# Altium project koruza-hs-boad.PrjPcb
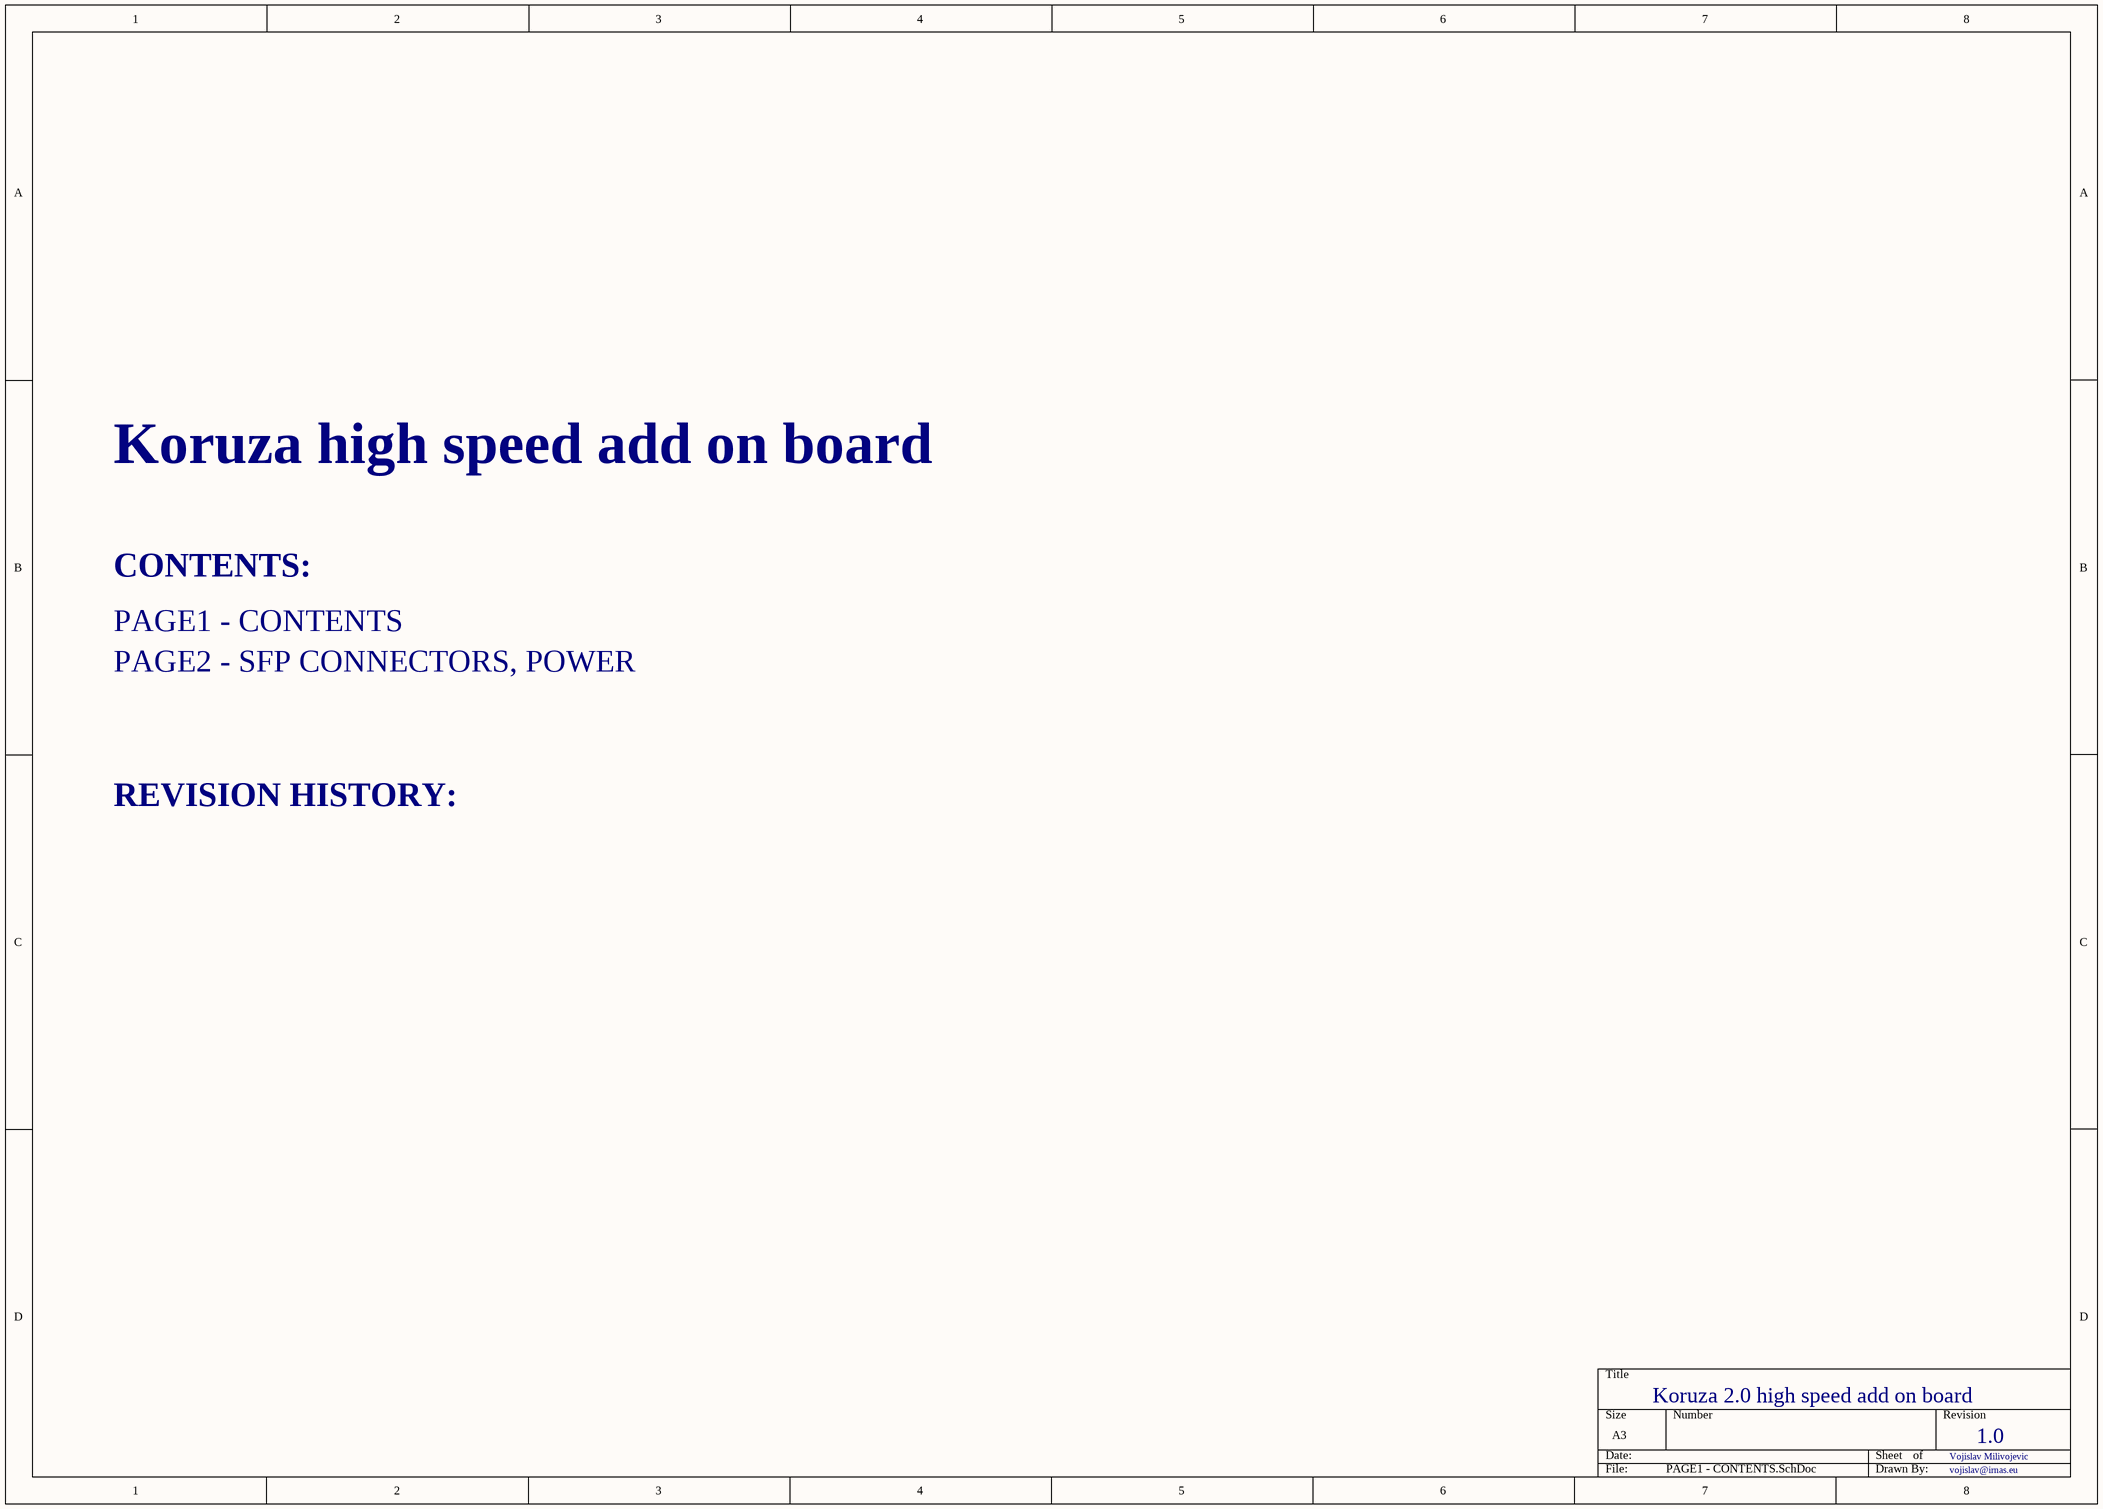
[diagram p0: PAGE1 - CONTENTS.SchDoc]
2 sheets, 44 parts. Net scope: global (net labels, ports and power ports of the same name join across sheets).
Board file: PCB.PcbDoc
Sheets:
  PAGE1 - CONTENTS.SchDoc
  PAGE2 - SFP CONNECTORS, POWER.SchDoc

## Sheet PAGE1 - CONTENTS.SchDoc
size A3

### Notes on the sheet
- Koruza high speed add on board
- CONTENTS:
- PAGE1 - CONTENTS
- PAGE2 - SFP CONNECTORS, POWER
- REVISION HISTORY:
- Koruza 2.0 high speed add on board
- Vojislav Milivojevic
- 1.0
- vojislav@irnas.eu

## Sheet PAGE2 - SFP CONNECTORS, POWER.SchDoc
size A3
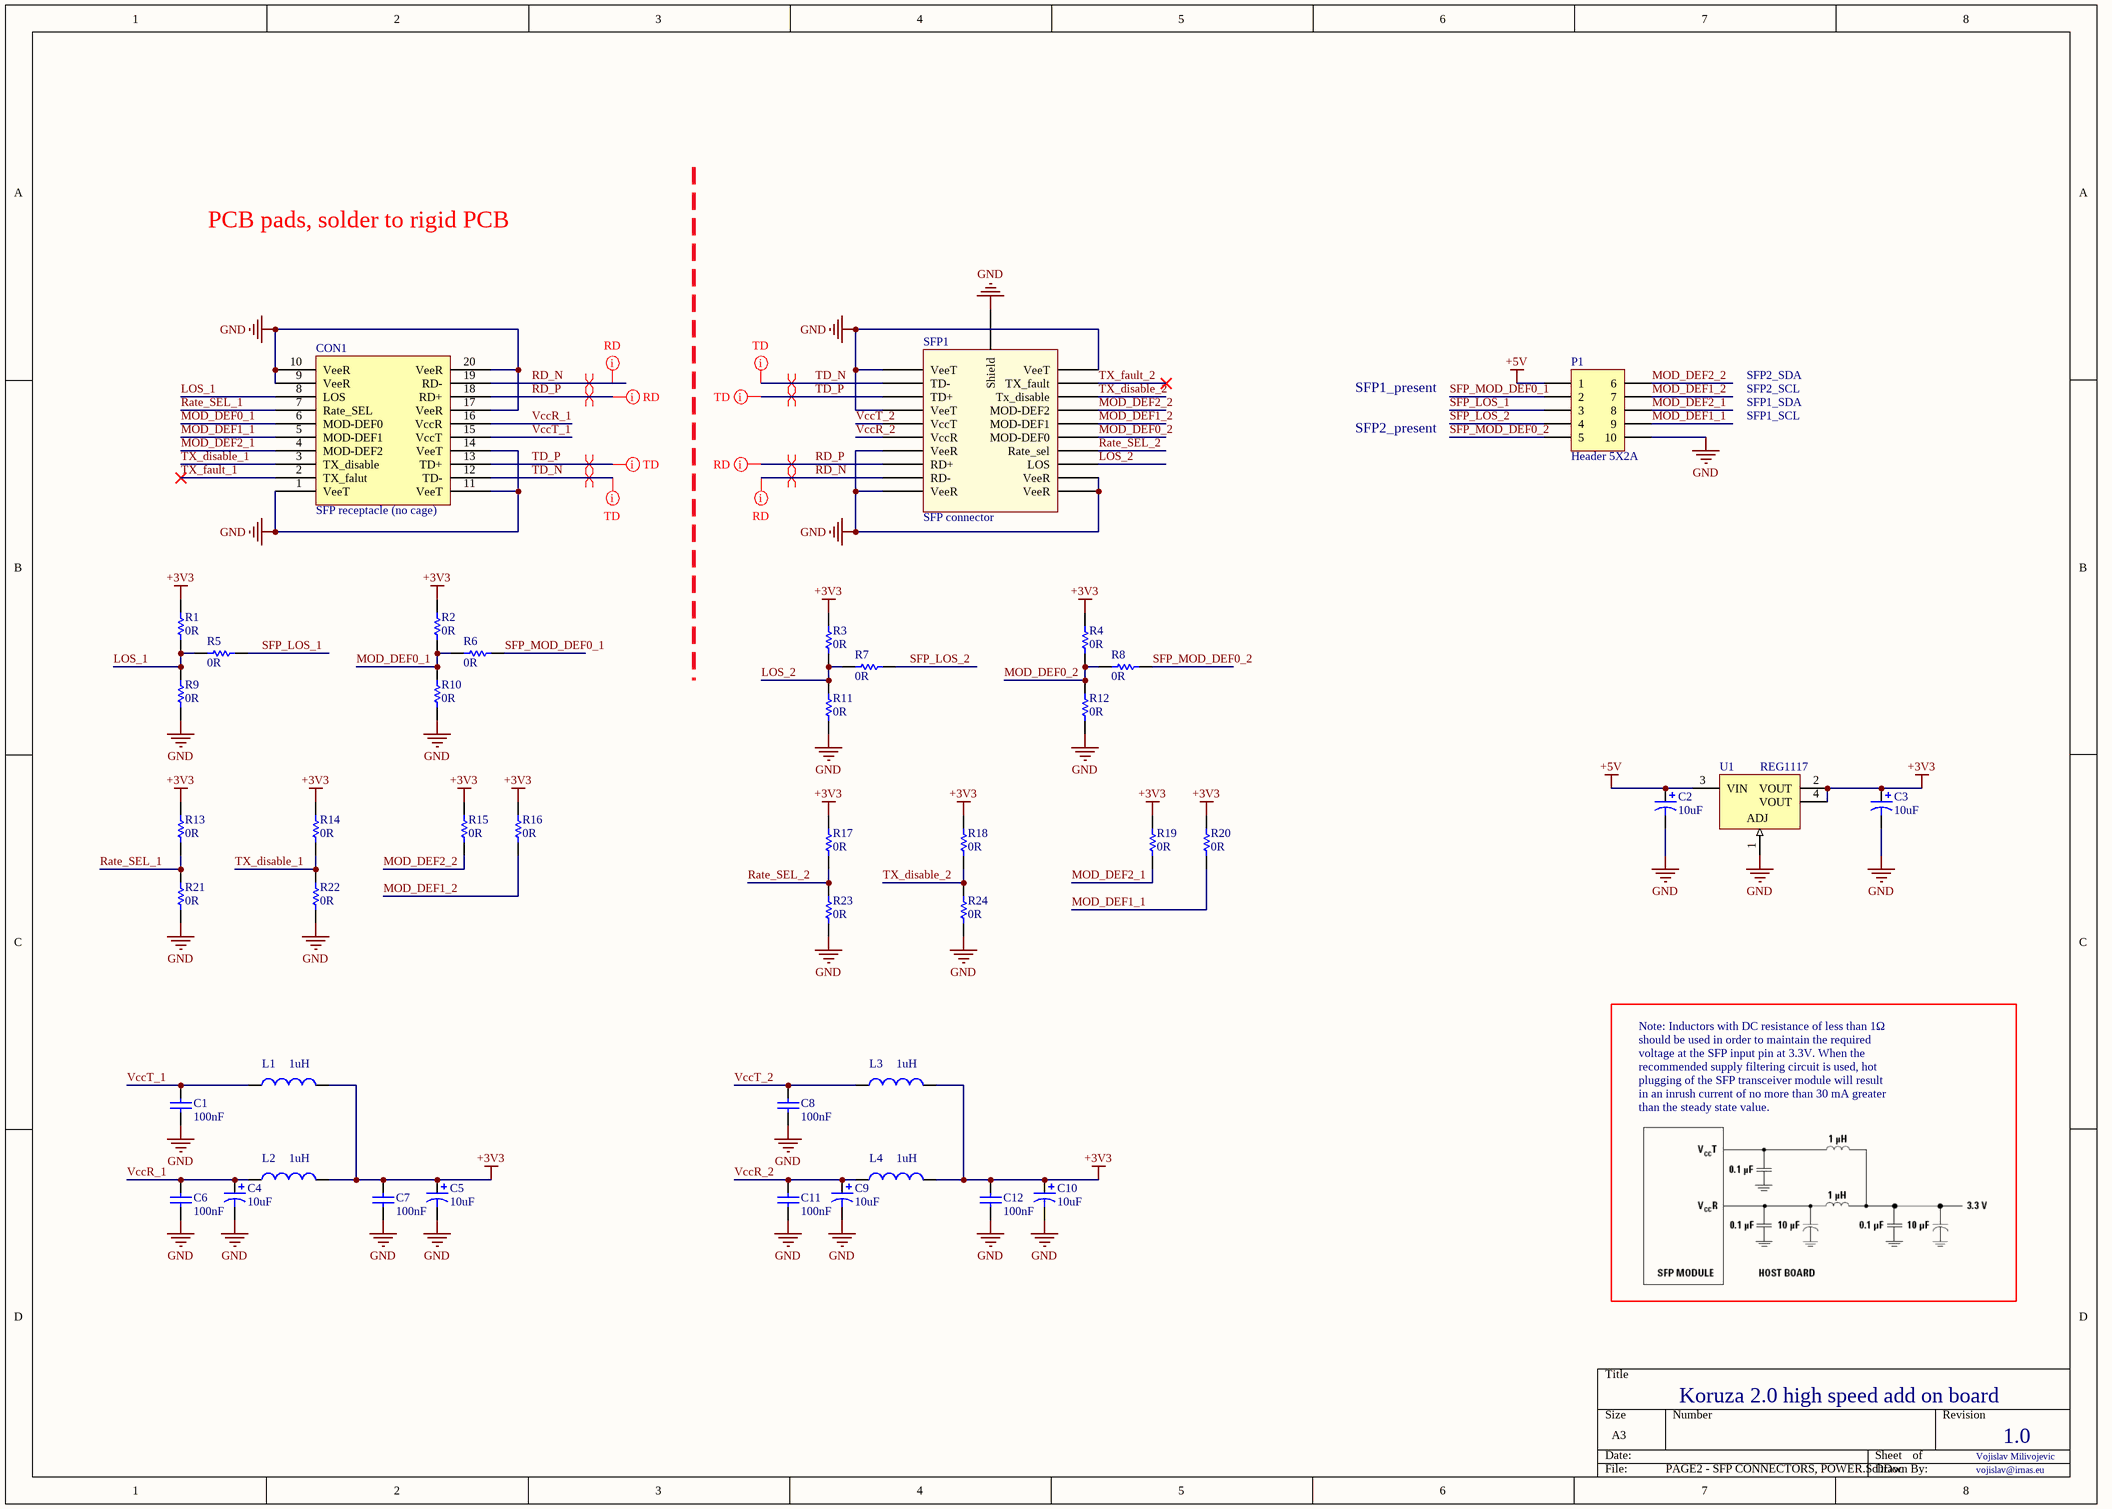
[diagram p1: PAGE2 - SFP CONNECTORS, POWER.SchDoc]

### Parts
C1  100nF  [CAP0603]
C2  10uF  [CAP0805]
C3  10uF  [CAP0805]
C4  10uF  [CAP0805]
C5  10uF  [CAP0805]
C6  100nF  [CAP0603]
C7  100nF  [CAP0603]
C8  100nF  [CAP0603]
C9  10uF  [CAP0805]
C10  10uF  [CAP0805]
C11  100nF  [CAP0603]
C12  100nF  [CAP0603]
CON1  SFP receptacle (no cage)  [PCB_SFP]
L1  1uH  [6-0805_N]
L2  1uH  [6-0805_N]
L3  1uH  [6-0805_N]
L4  1uH  [6-0805_N]
P1  Header 5X2A  [HDR2X5_CEN]
R1  0R  [RES0603]
R2  0R  [RES0603]
R3  0R  [RES0603]
R4  0R  [RES0603]
R5  0R  [RES0603]
R6  0R  [RES0603]
R7  0R  [RES0603]
R8  0R  [RES0603]
R9  0R  [RES0603]
R10  0R  [RES0603]
R11  0R  [RES0603]
R12  0R  [RES0603]
R13  0R  [RES0603]
R14  0R  [RES0603]
R15  0R  [RES0603]
R16  0R  [RES0603]
R17  0R  [RES0603]
R18  0R  [RES0603]
R19  0R  [RES0603]
R20  0R  [RES0603]
R21  0R  [RES0603]
R22  0R  [RES0603]
R23  0R  [RES0603]
R24  0R  [RES0603]
SFP1  SFP connector  [PCB_SFP_COVER]
U1  REG1117  [TI-DCY4_N]

### Nets
+3V3: C3.1 C5.1 C7.2 C10.1 C12.2 L1.2 L2.2 L3.2 L4.2 R1.1 R2.1 R3.1 R4.1 R13.1 R14.1 R15.1 R16.1 R17.1 R18.1 R19.1 R20.1 U1.2(VOUT) U1.4(VOUT)
+5V: C2.1 P1.1 U1.3(VIN)
GND: C1.1 C2.2 C3.2 C4.2 C5.2 C6.1 C7.1 C8.1 C9.2 C10.2 C11.1 C12.1 CON1.1(VeeT) CON1.9(VeeR) CON1.10(VeeR) CON1.11(VeeT) CON1.14(VeeT) CON1.17(VeeR) CON1.20(VeeR) P1.10 R9.2 R10.2 R11.2 R12.2 R21.2 R22.2 R23.2 R24.2 SFP1.1(VeeT) SFP1.9(VeeR) SFP1.10(VeeR) SFP1.11(VeeR) SFP1.14(VeeR) SFP1.17(VeeT) SFP1.20(VeeT) SFP1.21(Shield) U1.1(ADJ)
LOS_1: CON1.8(LOS) R1.2 R5.1 R9.1
LOS_2: R3.2 R7.1 R11.1 SFP1.8(LOS)
MOD_DEF0_1: CON1.6(MOD-DEF0) R2.2 R6.1 R10.1
MOD_DEF0_2: R4.2 R8.1 R12.1 SFP1.6(MOD-DEF0)
MOD_DEF1_1: CON1.5(MOD-DEF1) P1.9 R20.2
MOD_DEF1_2: P1.7 R16.2 SFP1.5(MOD-DEF1)
MOD_DEF2_1: CON1.4(MOD-DEF2) P1.8 R19.2
MOD_DEF2_2: P1.6 R15.2 SFP1.4(MOD-DEF2)
Rate_SEL_1: CON1.7(Rate_SEL) R13.2 R21.1
Rate_SEL_2: R17.2 R23.1 SFP1.7(Rate_sel)
RD_N: CON1.19(RD-) SFP1.12(RD-)
RD_P: CON1.18(RD+) SFP1.13(RD+)
SFP_LOS_1: P1.3 R5.2
SFP_LOS_2: P1.4 R7.2
SFP_MOD_DEF0_1: P1.2 R6.2
SFP_MOD_DEF0_2: P1.5 R8.2
TD_N: CON1.12(TD-) SFP1.19(TD-)
TD_P: CON1.13(TD+) SFP1.18(TD+)
TX_disable_1: CON1.3(TX_disable) R14.2 R22.1
TX_disable_2: R18.2 R24.1 SFP1.3(Tx_disable)
TX_fault_1: CON1.2(TX_falut)
TX_fault_2: SFP1.2(TX_fault)
VccR_1: C4.1 C6.2 CON1.16(VccR) L2.1
VccR_2: C9.1 C11.2 L4.1 SFP1.15(VccR)
VccT_1: C1.2 CON1.15(VccT) L1.1
VccT_2: C8.2 L3.1 SFP1.16(VccT)

### Layout directives
differential pair: RD_N, RD_P, TD_N, TD_P
net class RD: RD_N, RD_P
net class TD: TD_N, TD_P

### Notes on the sheet
- PCB pads, solder to rigid PCB
- SFP2_SDA
- SFP1_present
- SFP2_present
- SFP2_SCL
- SFP1_SDA
- SFP1_SCL
- Note: Inductors with DC resistance of less than 1Ω
  should be used in order to maintain the required
  voltage at the SFP input pin at 3.3V. When the
  recommended supply filtering circuit is used, hot
  plugging of the SFP transceiver module will result
  in an inrush current of no more than 30 mA greater
  than the steady state value.
- Koruza 2.0 high speed add on board
- Vojislav Milivojevic
- 1.0
- vojislav@irnas.eu

### Library data of the parts
C1 C6-C8 C11 C12 = Cap: Capacitor; Published: 8-Jun-2000; LatestRevisionDate: 17-Jul-2002; LatestRevisionNote: Re-released for DXP Platform.; PackageReference: RAD-0.3; Publisher: Altium Limited; PackageDescription: Radial Cap, Thru-Hole; 2 Leads; 0.3 in Pin Spacing; Value: 100nF
C2-C5 C9 C10 = Cap Pol1: Polarized Capacitor (Radial); Published: 8-Jun-2000; LatestRevisionDate: 17-Jul-2002; LatestRevisionNote: Re-released for DXP Platform.; PackageReference: RB7.6-15; Publisher: Altium Limited; PackageDescription: Polarized Capacitor (Radial); 2 Leads; Value: 10uF
CON1 = SFP connector: SFP receptacle, woutout cage, standard orientation of SFP module; Implementation: YES; Datasheet: *; Manifacturer: *; Manifacturer code: *; Value: *; Supplier 1: Farnell; Supplier Part Number 1: 1629987
L1-L4 = Inductor: Code_IEC: 1005; Published: 8-Jun-2000; LatestRevisionDate: 29-May-2009; LatestRevisionNote: IPC-7351 Footprint Added.; PackageReference: 0402-A; Publisher: Altium Limited; PackageDescription: Chip Inductor; Code_JEITA: 0402; Value: 1uH
P1 = Header 5X2A: Header, 5-Pin, Dual row; LatestRevisionDate: 17-Jul-2002; LatestRevisionNote: Re-released for DXP Platform.; Publisher: Altium Limited
R1-R24 = Res1: Resistor; Published: 8-Jun-2000; LatestRevisionDate: 17-Jul-2002; LatestRevisionNote: Re-released for DXP Platform.; PackageReference: AXIAL-0.3; Publisher: Altium Limited; PackageDescription: Axial Device, Thru-Hole; 2 Leads; 0.3 in Pin Spacing; Value: 0R
U1 = REG1117: Single Output LDO, 800 mA, Adjustable 1.5 to 13.5 V Output, 3.8 to 15 V Input, with Internal Current Limiting, 4-pin SOT-223 (DCY), -40 to 125 degC, Green (RoHS & no Sb/Br); Manufacturer: Texas Instruments; Iout(Max)(A): 0.8; Iq(Typ)(mA): 4; Rating: Catalog; SubFamily: Single Channel LDO; Vdo(Typ)(mV): 1100; Vin(Max)(V): 15; Vin(Min)(V): 3.8; Vout Adj(Max)(V): 13.5; Vout Adj(Min)(V): 1.25; DatasheetVersion: SBVS001D; PackageVersion: 4202506/B; PackageReference: DCY4; PackageDescription: 4-Pin Plastic Small Outline, Body 3.5 x 6.5 mm, Pitch 2.3 mm; Supplier 1: Digi-Key; Supplier Part Number 1: REG1117-ND; Supplier 2: Farnell; Supplier Part Number 2: 1097566; Supplier 3: Newark; Supplier Part Number 3: 14P6981; Supplier 4: Mouser; Supplier Part Number 4: 595-REG1117; Eco-Plan: Green (RoHS & no Sb/Br); Mounting Technology: Surface Mount; Code_JEDEC: TO-261; PartNumber: REG1117; ComponentLink1Description: Manufacturer URL; ComponentLink1URL: http://www.ti.com/; ComponentLink2Description: Datasheet; ComponentLink2URL: http://www.ti.com/general/docs/lit/getliterature.tsp?genericPartNumber=REG1117&fileType=pdf; ComponentLink3Description: Package Specification; ComponentLink3URL: http://www.ti.com/litv/pdf/mpds094a